# EAGLE schematic Esp32-C6 (EAGLE 9.6.2)
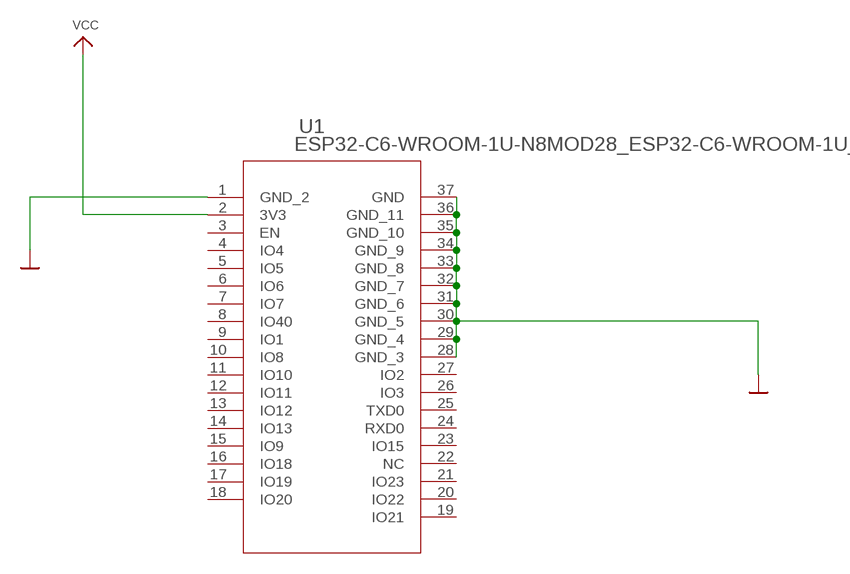
[diagram p0: schematic, sheet 1]

## Parts
U1  ESP32-C6-WROOM-1U-N8MOD28_ESP32-C6-WROOM-1U_EXP  [MOD28_ESP32-C6-WROOM-1U_EXP]

## Nets
GND: U1.1(GND_2) U1.28(GND_3) U1.29(GND_4) U1.30(GND_5) U1.31(GND_6) U1.32(GND_7) U1.33(GND_8) U1.34(GND_9) U1.35(GND_10) U1.36(GND_11) U1.37(GND)
VCC: U1.2(3V3)
Unconnected: U1.3(EN) U1.4(IO4) U1.5(IO5) U1.6(IO6) U1.7(IO7) U1.8(IO40) U1.9(IO1) U1.10(IO8) U1.11(IO10) U1.12(IO11) U1.13(IO12) U1.14(IO13) U1.15(IO9) U1.16(IO18) U1.17(IO19) U1.18(IO20) U1.19(IO21) U1.20(IO22) U1.21(IO23) U1.22(NC) U1.23(IO15) U1.24(RXD0) U1.25(TXD0) U1.26(IO3) U1.27(IO2)

## Library data of the parts
U1 = 2025-01-22_11-27-58_Library:ESP32-C6-WROOM-1U-N8; COPYRIGHT: Copyright (C) 2025 Ultra Librarian. All rights reserved.; MANUFACTURER_PART_NUMBER: ESP32-C6-WROOM-1U-N8; MFR_NAME: Espressif Systems; TYPE: RF